# Altium schematic sheet Sheet13.SchDoc
size A4
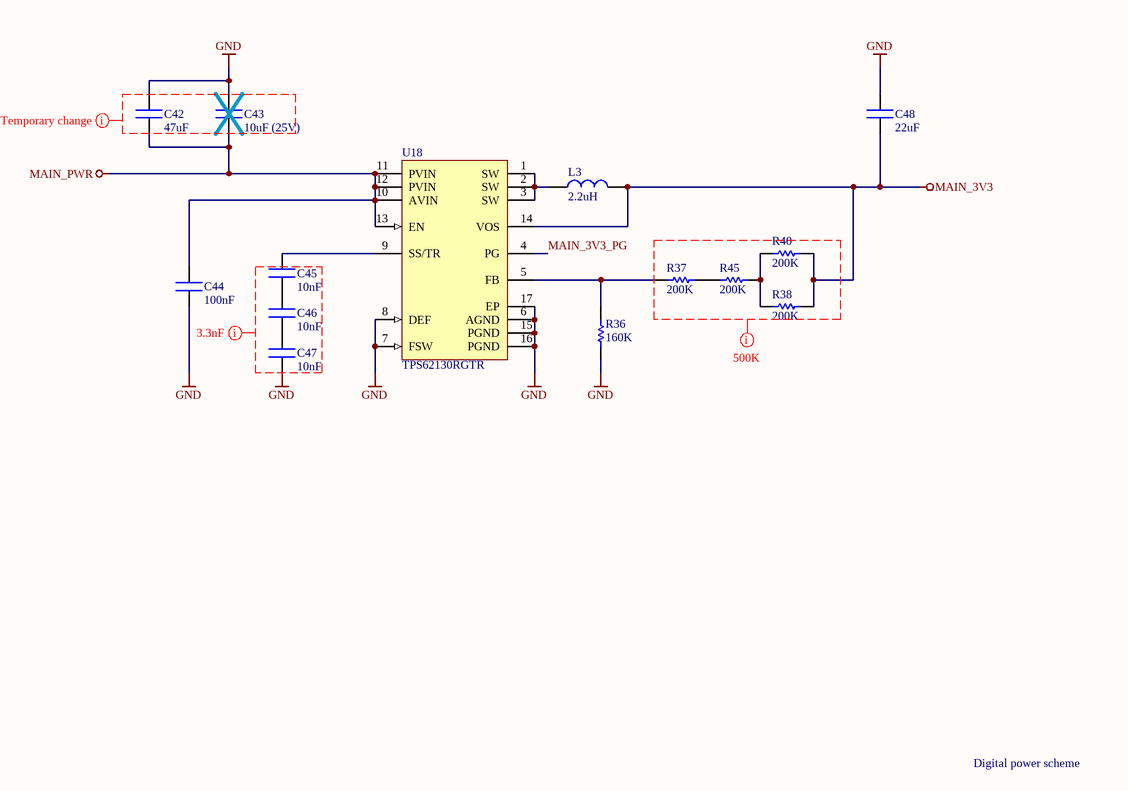
[diagram p0: Sheet13.SchDoc]

## Parts
C42  47uF  [CAPC2012X12N]
C43  10uF (25V)  [CAPC3216X16N]
C44  100nF  [CAPC1608X08N]
C45  10nF  [CAPC1005X05N]
C46  10nF  [CAPC1005X05N]
C47  10nF  [CAPC1005X05N]
C48  22uF  [CAPC1608X08N]
L3  2.2uH  [IHLP1212BZER2R2M11]
R36  160K  [RESC1005X05N]
R37  200K  [RESC1005X05N]
R38  200K  [RESC1005X05N]
R40  200K  [RESC1005X05N]
R45  200K  [RESC1005X05N]
U18  TPS62130RGTR  [TPS62130RGTR]

## Nets
GND: C42.2 C43.2 C44.1 C47.1 C48.2 R36.1 U18.6(AGND) U18.7(FSW) U18.8(DEF) U18.15(PGND) U18.16(PGND) U18.17(EP)
MAIN_3V3: C48.1 L3.2 R38.2 R40.2 U18.14(VOS)
MAIN_PWR: C42.1 C43.1 C44.2 U18.10(AVIN) U18.11(PVIN) U18.12(PVIN) U18.13(EN)
MAIN_3V3_PG: U18.4(PG)
NetC45_1: C45.1 C46.2
NetC45_2: C45.2 U18.9(SS/TR)
NetC46_1: C46.1 C47.2
NetL3_1: L3.1 U18.1(SW) U18.2(SW) U18.3(SW)
NetR36_2: R36.2 R37.2 U18.5(FB)
NetR37_1: R37.1 R45.2
NetR38_1: R38.1 R40.1 R45.1

## Layout directives
mark named 3.3nF: GND
mark named Temporary change: (no net found under the mark)
mark named 500K: (no net found under the mark)

## Notes on the sheet
- Digital power scheme

## Library data of the parts
C42 = C0805: Ceramic Chip Capacitor; Value: 47uF
C43 = C1206: Ceramic Chip Capacitor; Value: 10uF (25V)
C44 C48 = C0603: Ceramic Chip Capacitor
  C44: Value: 100nF
  C48: Value: 22uF
C45-C47 = C0402: Ceramic Chip Capacitor; Value: 10nF
L3 = IHLP1212BZER2R2M11: Commercial Inductors, Low DCR Series; Value: 2.2uH
R36-R38 R40 R45 = R0402: Ceramic Chip Resistor
  R36: Value: 160K
  R37 R38 R40 R45: Value: 200K
U18 = TPS62130RGTR: Buck Step Down Regulator with 3 to 17 V Input and 0.9 to 6 V Output, -40 to 85 degC, 16-Pin QFN (RGT), Green (RoHS & no Sb/Br); Manufacturer: Texas Instruments; Duty Cycle(Max)(%): 100; Iout(Max)(A): 3; Iq(Typ)(mA): 0.017; Rating: Catalog; Regulated Outputs(#): 1; SubFamily: Step-Down Regulator; Switch Current Limit(Typ)(A): 4.2; Synchronous Rectification: TRUE; Vin(Max)(V): 17; Vout(Max)(V): 6; Vout(Min)(V): 0.9; DatasheetVersion: SLVSAG7; PackageVersion: revH, Oct-2011; PackageReference: RGT16-1700X1700TP; PackageDescription: 16-Pin Plastic Quad Flat No-Lead, 3 x 3 mm Body, 0.5 mm Pitch, 1.7 x 1.7 mm Exposed Pad; Supplier 1: Digi-Key; Supplier Part Number 1: TPS62130RGTR-ND; Supplier 2: Newark; Supplier Part Number 2: 74T5526; Supplier 3: Mouser; Supplier Part Number 3: 595-TPS62130RGTR; Eco-Plan: Green (RoHS & no Sb/Br); Topology: Buck; Vin(Min)(V): 3; Mounting Technology: Surface Mount; Code_JEDEC: MO-220; PartNumber: TPS62130RGTR; ComponentLink1Description: Datasheet; ComponentLink1URL: http://www.ti.com/general/docs/lit/getliterature.tsp?genericPartNumber=TPS62130&fileType=pdf; ComponentLink2Description: Package Specification; ComponentLink2URL: http://www.ti.com/litv/pdf/mpqf119g; ComponentLink3Description: URL Link1; ComponentLink3URL: Samples URL:http://www.ti.com/product/tps62130#samples